# Altium schematic sheet Sheet2.SchDoc
size A4; SheetNumber: 1; SheetTotal: 1; SPICEModelCacheXUMEGEWJ: <root> / <DocumentId>XUMEGEWJ</DocumentId> / <CacheFrame Number="0"> / <Model Name="cap" Kind="MDL"> / <Text>*Default semiconductor capacitor / .MODEL CAP C()</Text> / </Model> / </CacheFrame> / </root>
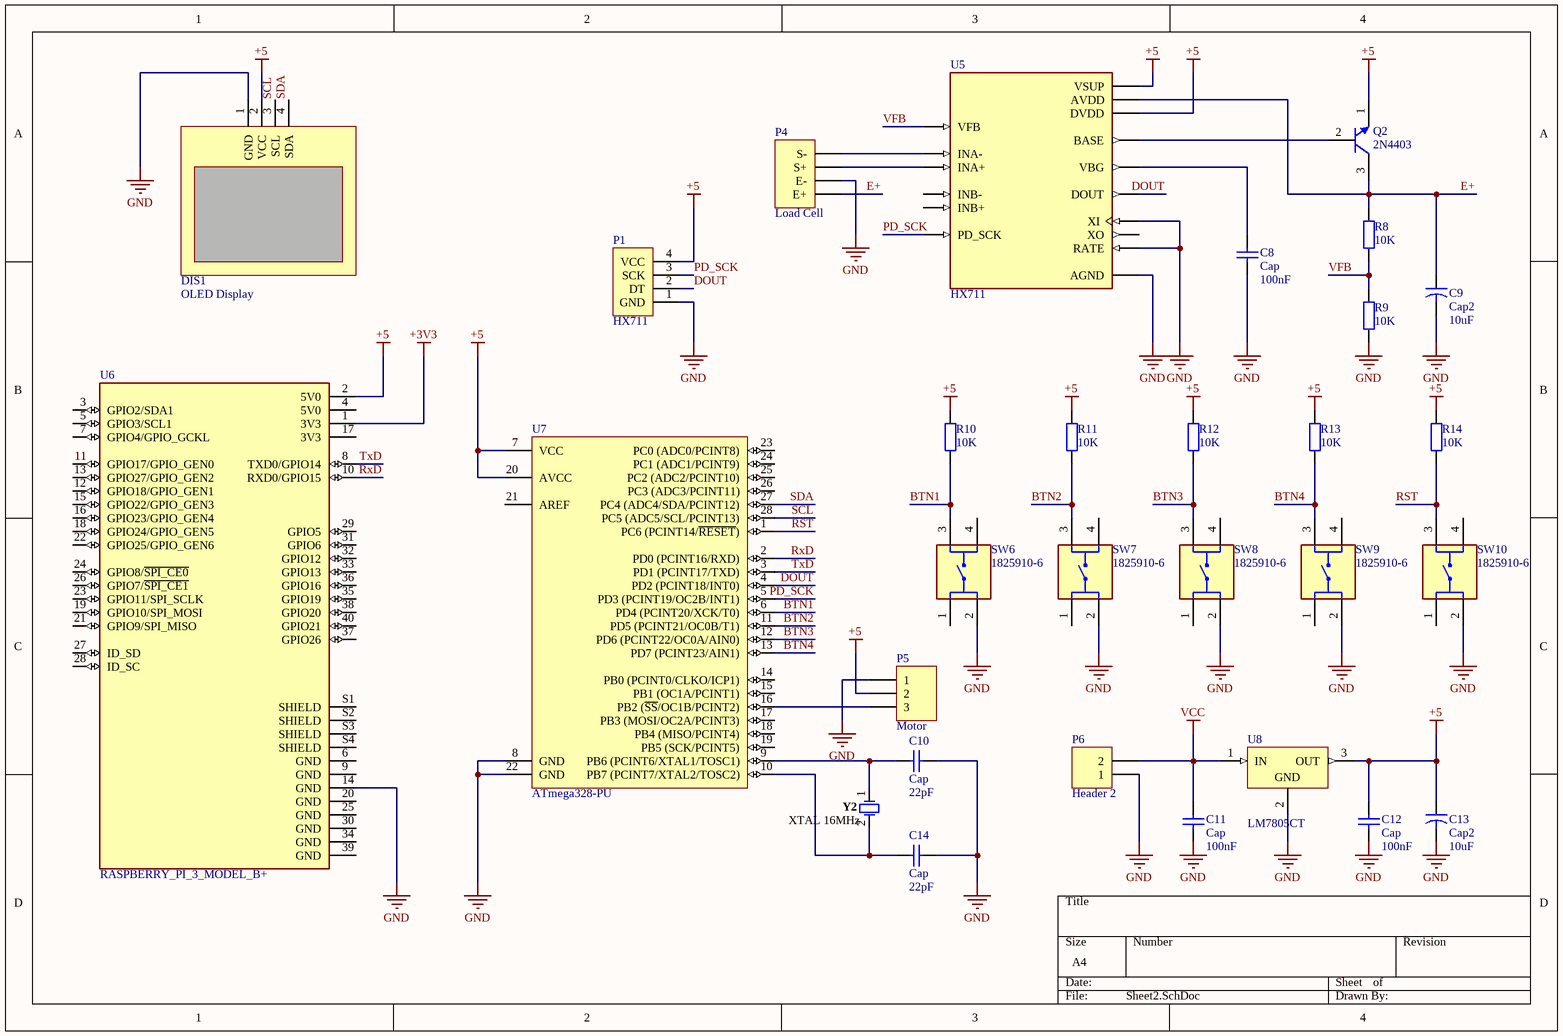
[diagram p0: Sheet2.SchDoc]

## Parts
C8  Cap  value 100nF  [RAD-0.2]
C9  Cap2  value 10uF  [R38]
C10  Cap  value 22pF  [RAD-0.1]
C11  Cap  value 100nF  [RAD-0.2]
C12  Cap  value 100nF  [RAD-0.2]
C13  Cap2  value 10uF  [R38]
C14  Cap  value 22pF  [RAD-0.1]
DIS1  OLED Display  [OLED12864I2C]
P1  HX711  [HDR1X4]
P4  Load Cell  [HDR1X4]
P5  Motor  [HDR1X3]
P6  Header 2  [HDR1X2]
Q2  2N4403  [ONSC-TO-92-3-29-11_AM_BL]
R8  value 10K  [AXIAL-0.4]
R9  value 10K  [AXIAL-0.4]
R10  value 10K  [AXIAL-0.4]
R11  value 10K  [AXIAL-0.4]
R12  value 10K  [AXIAL-0.4]
R13  value 10K  [AXIAL-0.4]
R14  value 10K  [AXIAL-0.4]
SW6  1825910-6  [SW_1825910-6-4]
SW7  1825910-6  [SW_1825910-6-4]
SW8  1825910-6  [SW_1825910-6-4]
SW9  1825910-6  [SW_1825910-6-4]
SW10  1825910-6  [SW_1825910-6-4]
U5  HX711  [SOP127P600X180-16N]
U6  RASPBERRY_PI_3_MODEL_B+  [MODULE_RASPBERRY_PI_3_MODEL_B+]
U7  ATmega328-PU  [28P3]
U8  LM7805CT  [FAIR-TO-220-3]
Y2  XTAL 16MHz  [FOX-FOXSLF-2_V]

## Nets
+3V3: U6.1(3V3)
+5: C12.2 C13.1 DIS1.2(VCC) P1.4(VCC) P5.2 Q2.1(E) R10.2 R11.2 R12.2 R13.2 R14.2 U5.1(VSUP) U5.16(DVDD) U6.2(5V0) U7.7(VCC) U7.20(AVCC) U8.3(OUT)
GND: C8.1 C9.2 C10.2 C11.1 C12.1 C13.2 C14.2 DIS1.1(GND) P1.1(GND) P4.2(E-) P5.1 P6.1 R9.1 SW6.2 SW7.2 SW8.2 SW9.2 SW10.2 U5.5(AGND) U5.14(XI) U5.15(RATE) U6.14(GND) U7.8(GND) U7.22(GND) U8.2(GND)
VCC: C11.2 P6.2 U8.1(IN)
BTN1: R10.1 SW6.3 U7.6(PD4_(PCINT20/XCK/T0))
BTN2: R11.1 SW7.3 U7.11(PD5_(PCINT21/OC0B/T1))
BTN3: R12.1 SW8.3 U7.12(PD6_(PCINT22/OC0A/AIN0))
BTN4: R13.1 SW9.3 U7.13(PD7_(PCINT23/AIN1))
DOUT: P1.2(DT) U5.12(DOUT) U7.4(PD2_(PCINT18/INT0))
E+: C9.1 P4.1(E+) Q2.3(C) R8.2 U5.3(AVDD)
PD_SCK: P1.3(SCK) U5.11(PD_SCK) U7.5(PD3_(PCINT19/OC2B/INT1))
RST: R14.1 SW10.3 U7.1(PC6_(PCINT14/~{RESET}))
RxD: U6.10(RXD0/GPIO15) U7.2(PD0_(PCINT16/RXD))
SCL: DIS1.3(SCL) U7.28(PC5_(ADC5/SCL/PCINT13))
SDA: DIS1.4(SDA) U7.27(PC4_(ADC4/SDA/PCINT12))
TxD: U6.8(TXD0/GPIO14) U7.3(PD1_(PCINT17/TXD))
VFB: R8.1 R9.2 U5.4(VFB)
NetC8_2: C8.2 U5.6(VBG)
NetC10_1: C10.1 U7.9(PB6_(PCINT6/XTAL1/TOSC1)) Y2.1
NetC14_1: C14.1 U7.10(PB7_(PCINT7/XTAL2/TOSC2)) Y2.2
NetP4_3: P4.3(S+) U5.8(INA+)
NetP4_4: P4.4(S-) U5.7(INA-)
NetP5_3: P5.3 U7.16(PB2_(~{SS}/OC1B/PCINT2))
NetQ2_2: Q2.2(B) U5.2(BASE)

Not connected (* = marked no-connect by the designer): SW6 1 4; SW7 1 4; SW8 1 4; SW9 1 4; SW10 1 4; U5 9(INB-) 10(INB+) 13(XO); U6 3(GPIO2/SDA1) 4(5V0) 5(GPIO3/SCL1) 6(GND) 7(GPIO4/GPIO_GCKL) 9(GND) 11(GPIO17/GPIO_GEN0) 12(GPIO18/GPIO_GEN1) 13(GPIO27/GPIO_GEN2) 15(GPIO22/GPIO_GEN3) 16(GPIO23/GPIO_GEN4) 17(3V3) 18(GPIO24/GPIO_GEN5) 19(GPIO10/SPI_MOSI) 20(GND) 21(GPIO9/SPI_MISO) 22(GPIO25/GPIO_GEN6) 23(GPIO11/SPI_SCLK) 24(GPIO8/~{SPI_CE0}) 25(GND) 26(GPIO7/~{SPI_CE1}) 27(ID_SD) 28(ID_SC) 29(GPIO5) 30(GND) 31(GPIO6) 32(GPIO12) 33(GPIO13) 34(GND) 35(GPIO19) 36(GPIO16) 37(GPIO26) 38(GPIO20) 39(GND) 40(GPIO21) S1(SHIELD) S2(SHIELD) S3(SHIELD) S4(SHIELD); U7 14(PB0_(PCINT0/CLKO/ICP1)) 15(PB1_(OC1A/PCINT1)) 17(PB3_(MOSI/OC2A/PCINT3)) 18(PB4_(MISO/PCINT4)) 19(PB5_(SCK/PCINT5)) 21(AREF) 23(PC0_(ADC0/PCINT8)) 24(PC1_(ADC1/PCINT9)) 25(PC2_(ADC2/PCINT10)) 26(PC3_(ADC3/PCINT11))

## Library data of the parts
C8 C10-C12 C14 = Cap: Capacitor; Published: 8-Jun-2000; LatestRevisionDate: 17-Jul-2002; LatestRevisionNote: Re-released for DXP Platform.; PackageReference: RAD-0.3; Publisher: Altium Limited; PackageDescription: Radial Cap, Thru-Hole; 2 Leads; 0.3 in Pin Spacing
C9 C13 = Cap2: Capacitor; Published: 23-Sep-2002; PackageReference: CAPR5-4X5; Publisher: Altium Limited; PackageDescription: Capacitor; 2 Leads
DIS1 = OLED12864I2C
P1 = Header 4: Header, 4-Pin; LatestRevisionDate: 17-Jul-2002; LatestRevisionNote: Re-released for DXP Platform.; Publisher: Altium Limited
P4 = Header 4: Load Cell Connector, 4-Pin; LatestRevisionDate: 17-Jul-2002; LatestRevisionNote: Re-released for DXP Platform.; Publisher: Altium Limited
P5 = Header 3: Header, 3-Pin; LatestRevisionDate: 17-Jul-2002; LatestRevisionNote: Re-released for DXP Platform.; Publisher: Altium Limited
P6 = Header 2: Header, 2-Pin; LatestRevisionDate: 17-Jul-2002; LatestRevisionNote: Re-released for DXP Platform.; Publisher: Altium Limited
Q2 = CMP-1048-01491-1: General Purpose Transistor, NPN Silicon, 3-Pin TO-92, Pb-Free, Ammo Box; PartNumber: 2N4401RLRPG; Manufacturer: On Semiconductor; IC Continuous (A): 0.6; fT Min (MHz): 250; DatasheetVersion: Rev. 4; ComponentLink1URL: http://www.onsemi.com/; PackageDescription: 3-Pin Transistor Outline, Body 4.825 x 3.685 mm, Pitch 1.27 mm; ComponentLink2URL: http://www.onsemi.com/pub_link/Collateral/2N4401-D.PDF; Packing: Ammo Box; ComponentLink1Description: Manufacturer URL; ComponentLink3Description: Package Specification; PackageVersion: Rev. AM; Polarity: NPN; Mounting Technology: Through Hole; RoHS: TRUE; ComponentLink2Description: Datasheet; ComponentLink3URL: http://www.onsemi.com/pub_link/Collateral/MAC97-D.PDF; PackageReference: TO-92-3-29-11_AM_BL
R8-R14 = Res2: Resistor; Published: 8-Jun-2000; LatestRevisionDate: 17-Jul-2002; LatestRevisionNote: Re-released for DXP Platform.; PackageReference: AXIAL-0.4; Publisher: Altium Limited; PackageDescription: Axial Device, Thru-Hole; 2 Leads; 0.4 in Pin Spacing
SW6-SW10 = 1825910-6: Switch Tactile OFF (ON) SPST Round Button PC Pins 0.05A 24VDC 100000Cycles 1.57N Thru-Hole Loose; Package: None; MP: 1825910-6; Value: *; Price: None; Availability: Unavailable
U6 = RASPBERRY_PI_3_MODEL_B+: BCM2835 Raspberry Pi Model B+ - ARM11, VideoCore MPU Embedded Evaluation Board; Price: None; MP: RASPBERRY_PI_3_MODEL_B+; Value: *; Availability: Unavailable; Package: None
U7 = CMP-0095-00015-2: 8-bit AVR Microcontroller, 32KB Flash, 1KB EEPROM, 2KB SRAM, 28-pin PDIP, Industrial Grade (-40°C to 85°C); ComponentLink3Description: ATmega48A/48PA/88A/88PA/168A/168PA/328/328P Summary; RevisionNote: DatasheetVersion updated. URLs added.; DatasheetVersion: revD, May-2011; ComponentLink1URL: http://www.atmel.com/; PackageVersion: revB, Sep-2001; PackageDescription: 28-lead (0.300"/7.62mm Wide) Plastic Dual Inline Package (PDIP); PackageReference: 28P3; ComponentLink1Description: Manufacturer URL; ComponentLink2Description: ATmega48A/48PA/88A/88PA/168A/168PA/328/328P Datasheet; ComponentLink3URL: http://www.atmel.com/dyn/resources/prod_documents/8271S.pdf; ComponentLink2URL: http://www.atmel.com/dyn/resources/prod_documents/8271.pdf
U8 = CMP-2000-04938-1: Positive Voltage Regulator, 5 V, 1 A, -40 to 125 degC, 3-Pin TO-220, RoHS, Tube; Manufacturer: FairchildSemiconductor; Maximum Input Voltage: 35V; Maximum Quiescent Current: 8mA; Load Regulation: 100mV; Maximum Output Current: 2.2(Typ)A; Output Type: Fixed; Typical Dropout Voltage @ Current: 2@1AV; Rad Hard: No; Output Voltage: 5V; Accuracy: ±4%; Number of Outputs: 1; Category: LinearRegulator; Package Description: 3-Pin Through Hole Device, Body 10 x 4.5 mm, Pitch 2.54 mm; Packaging: Rail/Tube; Mounting: ThroughHole; Polarity: Positive; Manufacturer URL: https://www.fairchildsemi.com/; Line Regulation: 100mV; Datasheet Version: Aug-12; Datasheet URL: https://datasheet.ciiva.com/26904/lm7805ct-26904988.pdf; Package Reference: TO-220; Package URL: https://www.fairchildsemi.com/package-drawings/TO/TO220B03.pdf; Package: 3TO-220AB; Operating Temperature: -40to125degC; Type: Linear
Y2 = CMP-1749-00004-1: Resistance Weld Thru-Hole Crystal, 12 MHz, +/-30 ppm, -20 to 70 degC, 2-Pin THD, RoHS, Bulk; Elements: 1; Rds On Max: 115 mohm; Typical Rise Time: 90 ns; Max Power Dissipation: 2.5 W; Case\Package: TO-251-3; Input Capacitance: 350 pF; REACH SVHC: No SVHC; Length: 6.6 mm; ComponentLink1URL: http://www.foxonline.com/; PackageDescription: 2-Pin Through Hole Device, Body 11.35 x 4.65 mm, Pitch 4.88 mm; Radiation Hardening: No; Package Quantity: 70; Packaging: Rail/Tube; ComponentLink1Description: Manufacturer URL; Min Operating Temperature: -55 degC; Max Operating Temperature: 150 degC; RoHSCompliant: true; PackageReference: FOXSLF-2; DatasheetVersion: Mar-15; Pins: 3; Height: 6.1 mm; Mount: Through Hole; ComponentLink2URL: http://www.foxonline.com/pdfs/hc49slf.pdf; ComponentLink2Description: Datasheet; Width: 2.3 mm
U5 = HX711: Value: *; Availability: Unavailable; Price: None; MP: HX711; Package: None